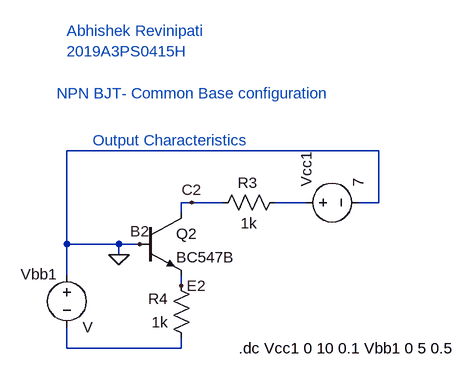
[diagram p0: schematic 2019A3PS0415_CB2.asc]
2019A3PS0415_CB2.asc, the LTspice schematic file:
Version 4
SHEET 1 1484 680
WIRE 1328 96 848 96
WIRE 1040 176 1024 176
WIRE 1088 176 1040 176
WIRE 1216 176 1168 176
WIRE 1328 176 1328 96
WIRE 1328 176 1296 176
WIRE 1024 192 1024 176
WIRE 848 240 848 96
WIRE 928 240 848 240
WIRE 960 240 928 240
WIRE 928 256 928 240
WIRE 848 288 848 240
WIRE 1024 304 1024 288
WIRE 848 400 848 368
WIRE 1024 400 1024 384
WIRE 1024 400 848 400
FLAG 928 256 0
FLAG 960 240 B2
FLAG 1040 176 C2
FLAG 1024 304 E2
SYMBOL npn 960 192 R0
SYMATTR InstName Q2
SYMATTR Value BC547B
SYMBOL voltage 1200 176 R270
WINDOW 123 0 0 Left 2
WINDOW 39 0 0 Left 2
SYMATTR InstName Vcc1
SYMATTR Value 7
SYMBOL voltage 848 272 R0
WINDOW 123 0 0 Left 2
WINDOW 39 0 0 Left 2
WINDOW 0 -71 14 Left 2
SYMATTR InstName Vbb1
SYMBOL res 1184 160 R90
WINDOW 0 1 58 VBottom 2
WINDOW 3 32 56 VTop 2
SYMATTR InstName R3
SYMATTR Value 1k
SYMBOL res 1040 400 R180
WINDOW 0 36 76 Left 2
WINDOW 3 36 40 Left 2
SYMATTR InstName R4
SYMATTR Value 1k
TEXT 832 8 Left 2 ;NPN BJT- Common Base configuration
TEXT 1112 400 Left 2 !.dc Vcc1 0 10 0.1 Vbb1 0 5 0.5
TEXT 888 80 Left 2 ;Output Characteristics
TEXT 848 -88 Left 2 ;Abhishek Revinipati\n2019A3PS0415H

The netlist it stands for:
* 2019A3PS0415_CB2.asc
Q2 C2 0 E2 0 BC547B
Vcc1 N001 0 7
Vbb1 0 N002 V
R3 N001 C2 1k
R4 N002 E2 1k
.model NPN NPN
.model PNP PNP
.lib standard.bjt
* NPN BJT- Common Base configuration
.dc Vcc1 0 10 0.1 Vbb1 0 5 0.5
* Output Characteristics
* Abhishek Revinipati
* 2019A3PS0415H
.backanno
.end